# EAGLE schematic card (EAGLE 8.4.1)

## Sheet 1 of 2
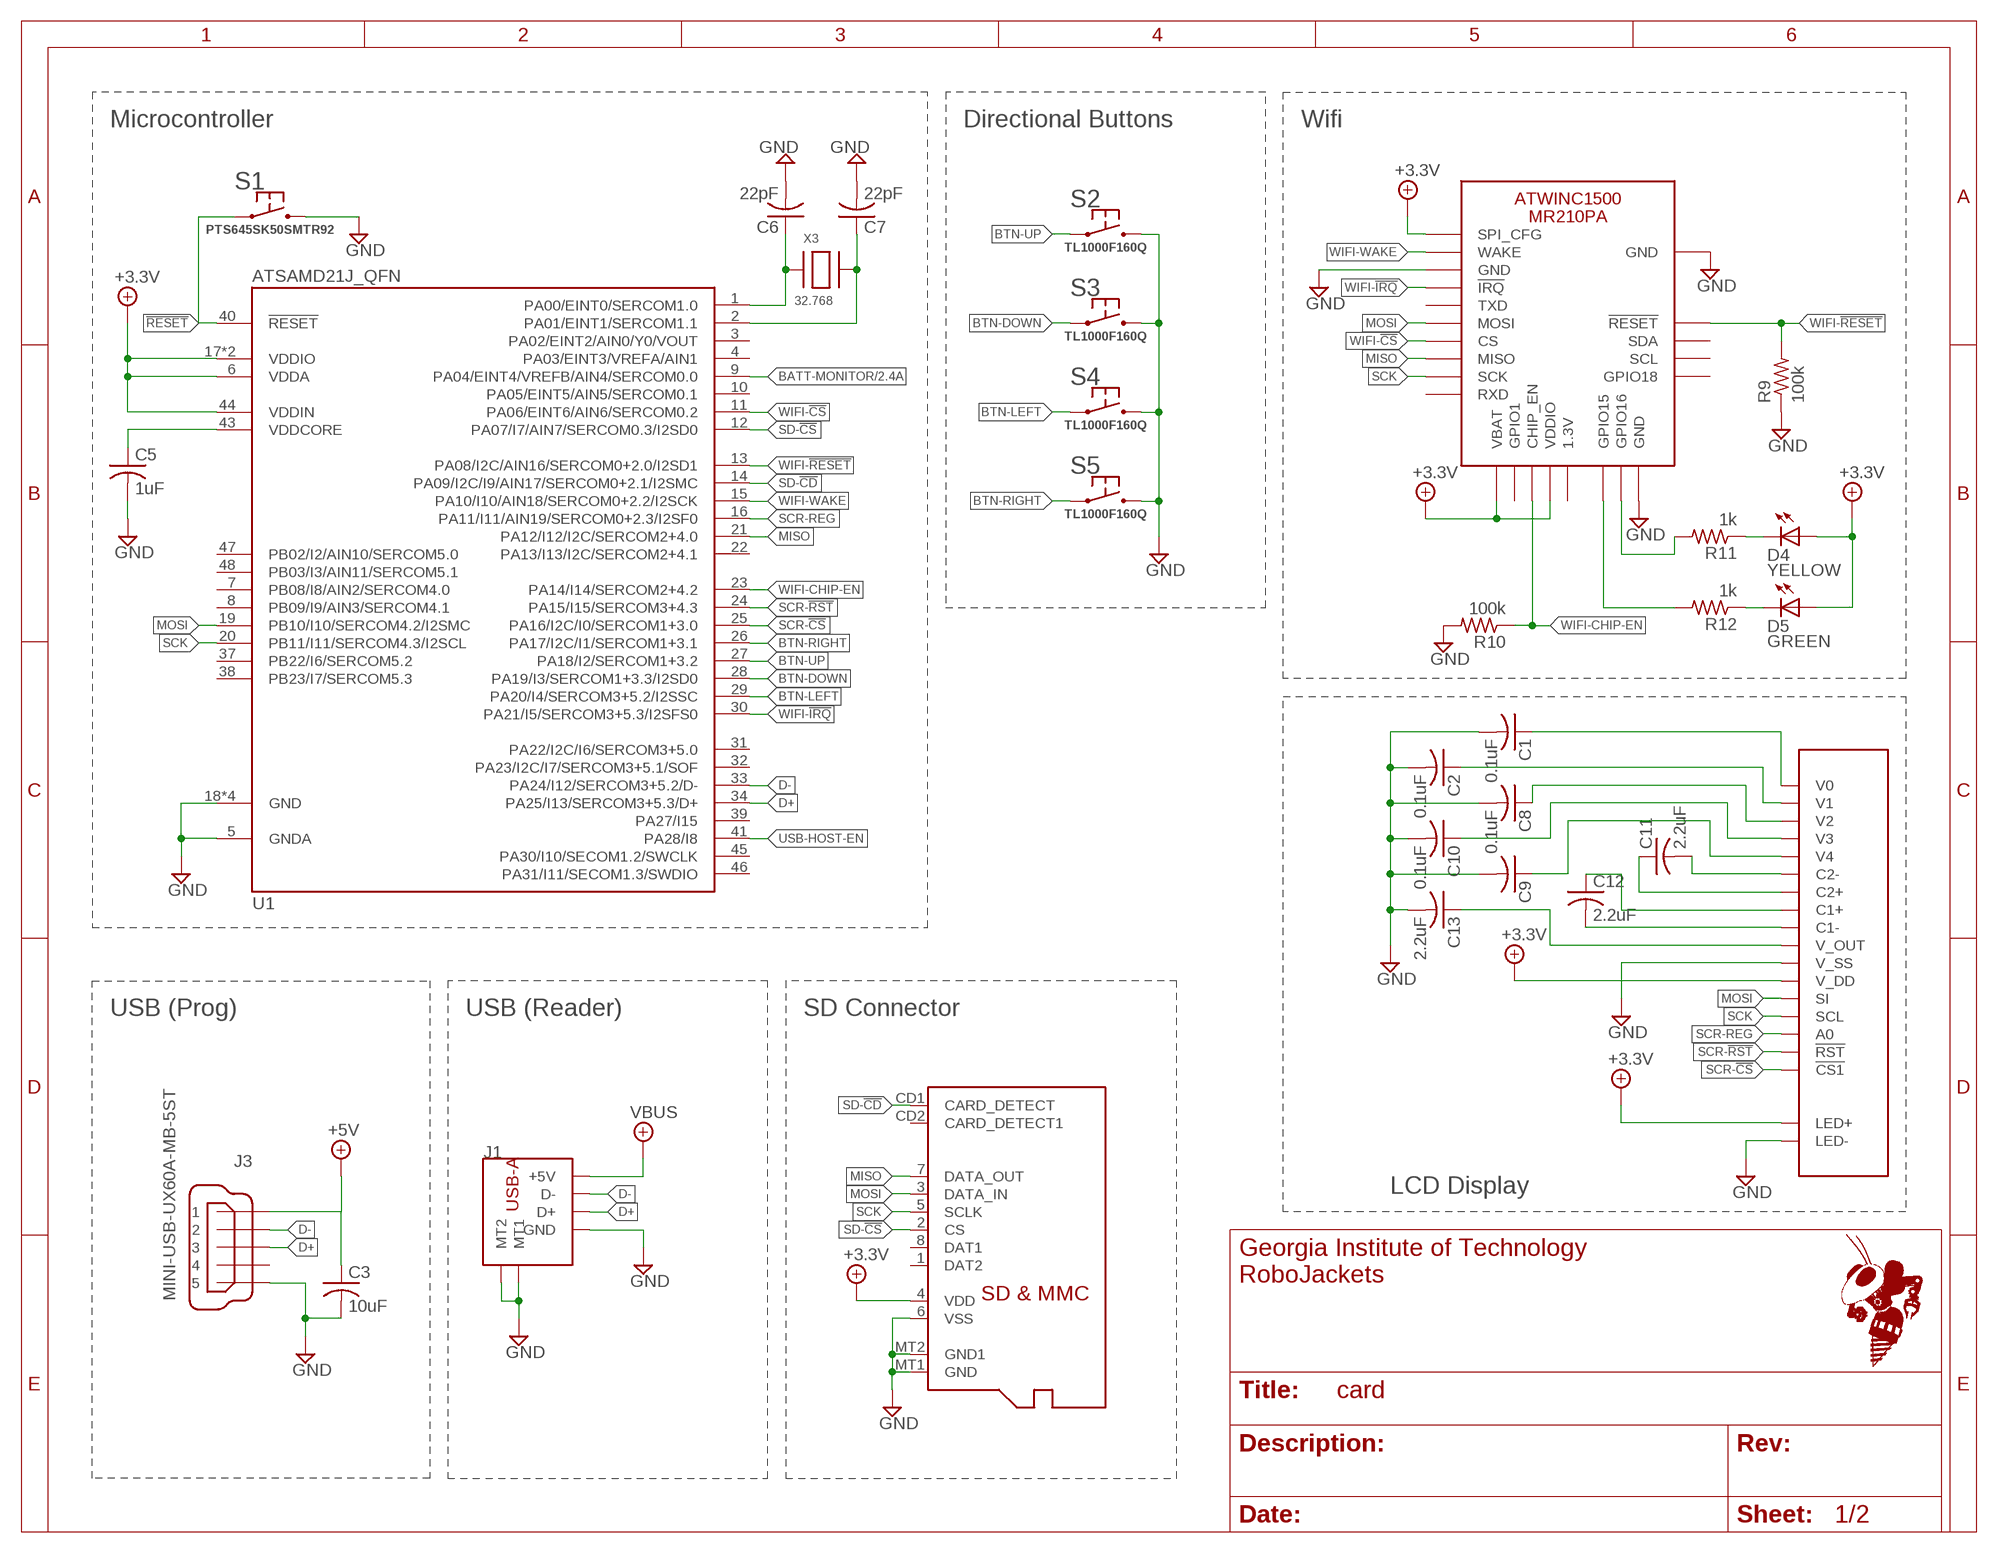
[diagram p0: schematic, sheet 1]
FRAME1 (FRAME_A_L): REVISION: 0.0; SCH_DESC: Standalone Magnetic card reader for Apiary; TEAM: Apiary

### Parts
C1  0.1uF  C-USC0603  [C0603]
C2  0.1uF  C-USC0603  [C0603]
C3  10uF  C-USC0805  [C0805]
C5  1uF  C-USC0603  [C0603]
C6  22pF  C-USC0603  [C0603]
C7  22pF  C-USC0603  [C0603]
C8  0.1uF  C-USC0603  [C0603]
C9  C-USC0603  [C0603]
C10  0.1uF  C-USC0603  [C0603]
C11  2.2uF  C-USC0603  [C0603]
C12  2.2uF  C-USC0603  [C0603]
C13  2.2uF  C-USC0603  [C0603]
D4  YELLOW  LED  [SMARTLED-TTW]
D5  GREEN  LED  [SMARTLED-TTW]
J1  UE27AC54100  [USB-A]
J3  MINI-USB-UX60A-MB-5ST  [UX60A-MB-5ST]
J4  MICROSD  [MICROSD]
R9  100k  R0603W  [R0603W]
R10  100k  R0603W  [R0603W]
R11  1k  R0603W  [R0603W]
R12  1k  R0603W  [R0603W]
S1  PTS645SK50SMTR92  [PTS645SK50SMTR92]
S2  TL1000F160Q  [TL1100]
S3  TL1000F160Q  [TL1100]
S4  TL1000F160Q  [TL1100]
S5  TL1000F160Q  [TL1100]
U1  ATSAMD21J_QFN  [TQFN48_7MM]
U4  ATWINC1500_MR210PA  [ATWINC1500_MR210PA]
U5  NHD-C12832A1Z-FSW-FBW-3V3  [NHD-C12832A1Z-FSW-FBW-3V3]
X3  32.768  XTAL-3.2X1.5  [XTAL3215]

### Nets
!RESET: S1.1 S1.2 U1.40(!RESET)
+3.3V: D4.A@1(A) D5.A@1(A) J4.4(VDD) U1.6(VDDA) U1.17(VDDIO) U1.36(VDDIO) U1.44(VDDIN) U4.J10(SPI_CFG) U4.J20(VBAT) U4.J23(VDDIO) U5.LED+ U5.V_DD ; also sheet 2
BATT-MONITOR: U1.9(PA04/EINT4/VREFB/AIN4/SERCOM0.0) ; also sheet 2
BTN-DOWN: S3.1 S3.2 U1.28(PA19/I3/SERCOM1+3.3/I2SD0)
BTN-LEFT: S4.1 S4.2 U1.29(PA20/I4/SERCOM3+5.2/I2SSC)
BTN-RIGHT: S5.1 S5.2 U1.26(PA17/I2C/I1/SERCOM1+3.1)
BTN-UP: S2.1 S2.2 U1.27(PA18/I2/SERCOM1+3.2)
D+: J1.3(D+) J3.3 U1.34(PA25/I13/SERCOM3+5.3/D+)
D-: J1.2(D-) J3.2 U1.33(PA24/I12/SERCOM3+5.2/D-)
GND: C1.2 C2.2 C3.2 C5.2 C6.2 C7.2 C8.2 C9.2 C10.2 C13.2 J1.4(GND) J1.MT1 J1.MT2 J3.5 J4.6(VSS) J4.MT1(GND) J4.MT2(GND1) R9.1(PIN1) R10.2(PIN2) S1.3 S1.4 S2.3 S2.4 S3.3 S3.4 S4.3 S4.4 S5.3 S5.4 U1.5(GNDA) U1.18(GND) U1.35(GND) U1.42(GND) U1.THERMAL(GND) U4.J9(GND) U4.J12(GND) U4.J28(GND) U5.LED- U5.V_SS ; also sheet 2
MISO: J4.7(DATA_OUT) U1.21(PA12/I12/I2C/SERCOM2+4.0) U4.J17(MISO)
MOSI: J4.3(DATA_IN) U1.19(PB10/I10/SERCOM4.2/I2SMC) U4.J15(MOSI) U5.SI
N$9: R11.2(PIN2) U4.J27(GPIO16)
N$10: R12.2(PIN2) U4.J26(GPIO15)
N$14: C5.1 U1.43(VDDCORE)
N$15: C6.1 U1.1(PA00/EINT0/SERCOM1.0) X3.P$1
N$16: C7.1 U1.2(PA01/EINT1/SERCOM1.1) X3.P$2
N$17: D4.C@1(C) R11.1(PIN1)
N$18: D5.C@1(C) R12.1(PIN1)
N$19: C1.1 U5.V0
N$20: C8.1 U5.V2
N$21: C10.1 U5.V3
N$22: C2.1 U5.V1
N$23: C9.1 U5.V4
N$24: C11.1 U5.C2+
N$25: C11.2 U5.C2-
N$26: C13.1 U5.V_OUT
N$27: C12.1
N$28: C12.2 U5.C1-
N$29: C3.1 J3.1
SCK: J4.5(SCLK) U1.20(PB11/I11/SERCOM4.3/I2SCL) U4.J18(SCK) U5.SCL
SCR-!CS: U1.25(PA16/I2C/I0/SERCOM1+3.0) U5.!CS1
SCR-!RST: U1.24(PA15/I15/SERCOM3+4.3) U5.!RST
SCR-REG: U1.16(PA11/I11/AIN19/SERCOM0+2.3/I2SF0) U5.A0
SD-!CD: J4.CD1(CARD_DETECT) U1.14(PA09/I2C/I9/AIN17/SERCOM0+2.1/I2SMC)
SD-!CS: J4.2(CS) U1.12(PA07/I7/AIN7/SERCOM0.3/I2SD0)
USB-HOST-EN: U1.41(PA28/I8)
VBUS: J1.1(+5V) ; also sheet 2
WIFI-!CS: U1.11(PA06/EINT6/AIN6/SERCOM0.2) U4.J16(CS)
WIFI-!IRQ: U1.30(PA21/I5/SERCOM3+5.3/I2SFS0) U4.J13(!IRQ)
WIFI-!RESET: R9.2(PIN2) U1.13(PA08/I2C/AIN16/SERCOM0+2.0/I2SD1) U4.J4(!RESET)
WIFI-CHIP-EN: R10.1(PIN1) U1.23(PA14/I14/SERCOM2+4.2) U4.J22(CHIP_EN)
WIFI-WAKE: U1.15(PA10/I10/AIN18/SERCOM0+2.2/I2SCK) U4.J11(WAKE)
Unconnected: J3.4 J4.1(DAT2) J4.8(DAT1) J4.CD2(CARD_DETECT1) U1.3(PA02/EINT2/AIN0/Y0/VOUT) U1.4(PA03/EINT3/VREFA/AIN1) U1.7(PB08/I8/AIN2/SERCOM4.0) U1.8(PB09/I9/AIN3/SERCOM4.1) U1.10(PA05/EINT5/AIN5/SERCOM0.1) U1.22(PA13/I13/I2C/SERCOM2+4.1) U1.31(PA22/I2C/I6/SERCOM3+5.0) U1.32(PA23/I2C/I7/SERCOM3+5.1/SOF) U1.37(PB22/I6/SERCOM5.2) U1.38(PB23/I7/SERCOM5.3) U1.39(PA27/I15) U1.45(PA30/I10/SECOM1.2/SWCLK) U1.46(PA31/I11/SECOM1.3/SWDIO) U1.47(PB02/I2/AIN10/SERCOM5.0) U1.48(PB03/I3/AIN11/SERCOM5.1) U4.J1(GPIO18) U4.J2(SCL) U4.J3(SDA) U4.J14(TXD) U4.J19(RXD) U4.J21(GPIO1) U4.J24(1.3V) U5.C1+

### Notes on the sheet
- Microcontroller | Directional Buttons | Wifi
- USB (Prog) | USB (Reader) | SD Connector
- LCD Display

## Sheet 2 of 2: Power
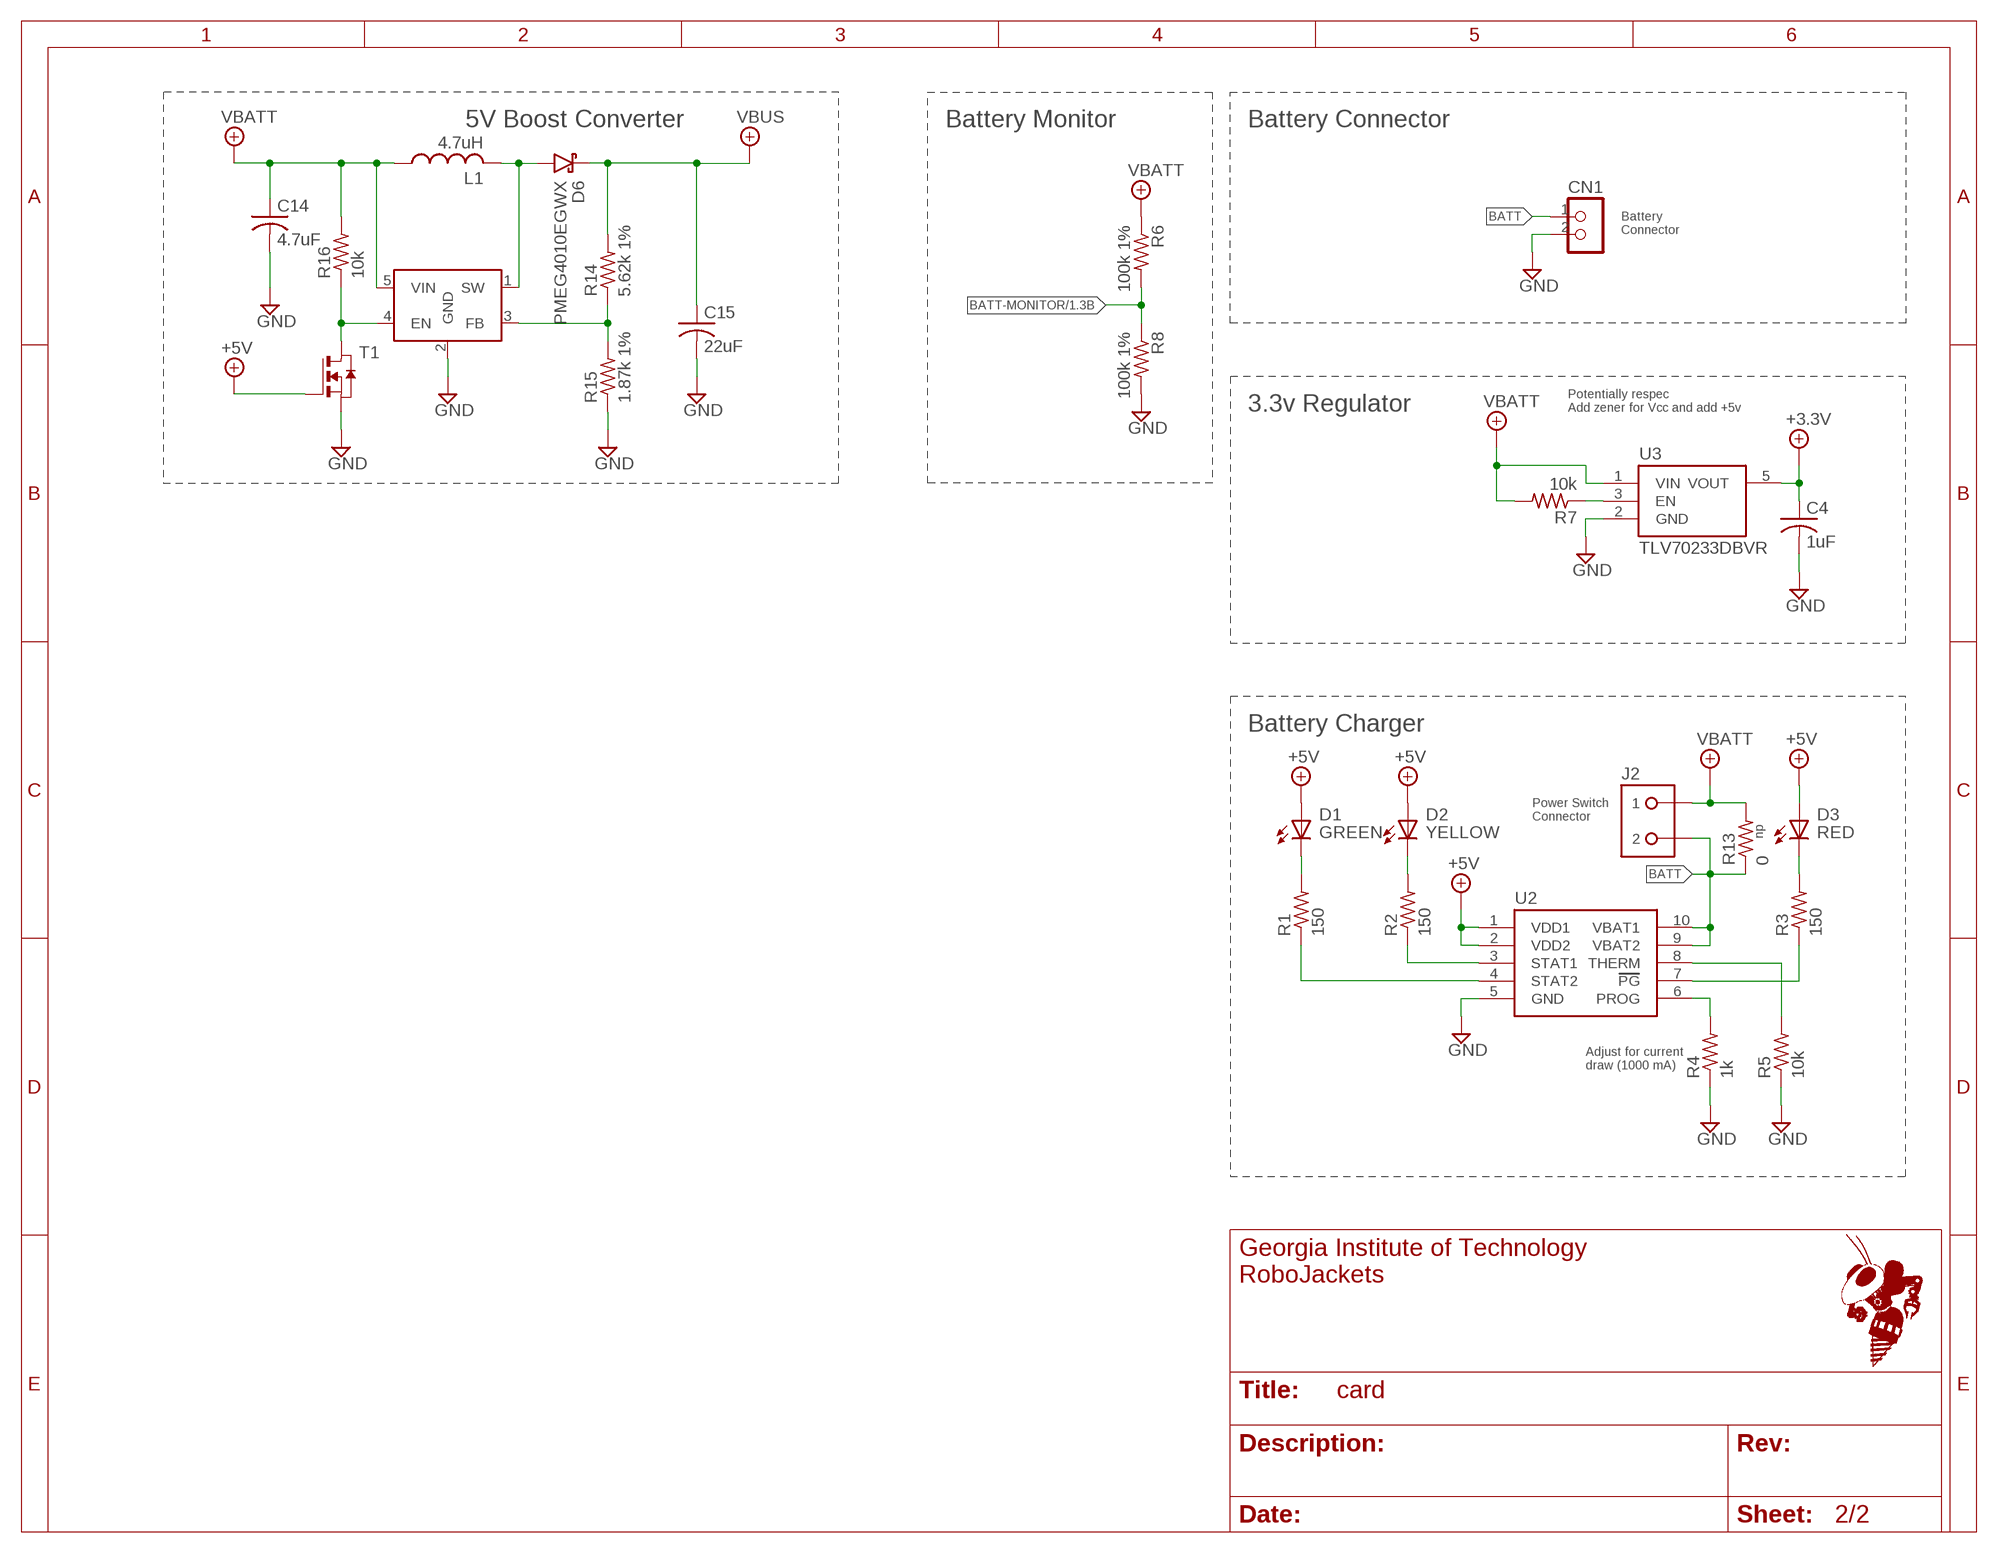
[diagram p1: schematic, sheet 2]

### Parts
C4  1uF  C-USC0603  [C0603]
C14  4.7uF  C-USC0603  [C0603]
C15  22uF  C-USC0603  [C0603]
CN1  JST_2PIN  [JSTPH2]
D1  GREEN  LED-SMD-GREEN  [CHIP-LED0603]
D2  YELLOW  LED-SMD-YELLOW  [CHIP-LED0603]
D3  RED  LED-SMD-RED  [CHIP-LED0603]
D6  PMEG4010EGWX  SCHOTTKEY-DIODE-SOD123  [SOD123]
J2  B2PS-VH(LF)(SN)  [B2PS-CENTERED]
L1  4.7uH  L-US-0805  [L0805]
R1  150  R-US_R0603  [R0603]
R2  150  R-US_R0603  [R0603]
R3  150  R-US_R0603  [R0603]
R4  1k  R-US_R0603  [R0603]
R5  10k  R-US_R0603  [R0603]
R6  100k 1%  R-US_R0603  [R0603]
R7  10k  R-US_R0603  [R0603]
R8  100k 1%  R-US_R0603  [R0603]
R13  0  R-US_R0603  [R0603]
R14  5.62k 1%  R-US_R0603  [R0603]
R15  1.87k 1%  R-US_R0603  [R0603]
R16  10k  R-US_R0603  [R0603]
T1  BSS138  [SOT-23]
U2  MCP73833  [MSOP10]
U3  TLV70233DBVR  [SOT-23-5]
U6  MIC2288YD5-TR  [TSOT-23-5]

### Nets
3V3_EN: R7.1 U3.3(EN)
+3.3V: C4.1 U3.5(VOUT) ; also sheet 1
+5V: D1.A D2.A D3.A T1.3(G) U2.1(VDD1) U2.2(VDD2) ; also sheet 1
BATT: CN1.1 J2.2 R13.1 U2.9(VBAT2) U2.10(VBAT1)
BATT-MONITOR: R6.2 R8.1 ; also sheet 1
BOOST_ENABLE: R16.1 T1.1(D) U6.4(EN)
BOOST_FB: R14.1 R15.2 U6.3(FB)
BOOST_SW: D6.A L1.2 U6.1(SW)
GND: C4.2 C14.2 C15.2 CN1.2 R4.1 R5.1 R8.2 R15.1 T1.2(S) U2.5(GND) U3.2(GND) U6.2(GND) ; also sheet 1
N$1: D1.C(K) R1.2
N$2: D2.C(K) R2.2
N$3: R2.1 U2.3(STAT1)
N$4: R1.1 U2.4(STAT2)
N$5: R3.1 U2.7(PG)
N$6: D3.C(K) R3.2
N$7: R4.2 U2.6(PROG)
N$8: R5.2 U2.8(THERM)
VBATT: C14.1 J2.1 L1.1 R6.1 R7.2 R13.2 R16.2 U3.1(VIN) U6.5(VIN)
VBUS: C15.1 D6.C R14.2 ; also sheet 1

### Notes on the sheet
- 5V Boost Converter | Battery Monitor | Battery Connector
- Battery
  Connector
- 3.3v Regulator
- Potentially respec
  Add zener for Vcc and add +5v
- Battery Charger
- Power Switch
  Connector
- np
- Adjust for current 
  draw (1000 mA)

## Library data of the parts
C1-C15 = rcl:C-US: CAPACITOR, American symbol
CN1 = lib-card:JST_2PIN: JST 2-Pin Right-Angle Connector PH-Series - 4UConnector: 17311 SH-Series - 4UConnector: 07278
D1 = lib-card:LED-SMD; DIGIKEY: 160-1446-1-ND; MPN: LTST-C191KGKT
D2 = lib-card:LED-SMD; DIGIKEY: 160-1448-1-ND; MPN: LTST-C191KSKT
D3 = lib-card:LED-SMD; DIGIKEY: 160-1447-1-ND; MPN: LTST-C191KRKT
D4 D5 = led:LED: LED OSRAM: - CHIPLED LG R971, LG N971, LY N971, LG Q971, LY Q971, LO R971, LY R971 LH N974, LH R974 LS Q976, LO Q976, LY Q976 LO Q996 - Hyper CHIPLED LW Q18S LB Q993, LB Q99A, LB R99A - SideLED LS A670, LO A670, LY A670, LG A670, LP A670 LB A673, LV A673, LT A673, LW A673 LH A674 LY A675 LS A676, LA A676, LO A676, LY A676, LW A676 LS A679, LY A679, LG A679 - Hyper Micro SIDELED® LS Y876, LA Y876, LO Y876, LY Y876 LT Y87S - SmartLED LW L88C, LW L88S LB L89C, LB L89S, LG L890 LS L89K, LO L89K, LY L89K LS L896, LA L896, LO L896, LY L896 - TOPLED LS T670, LO T670, LY T670, LG T670, LP T670 LSG T670, LSP T670, LSY T670, LOP T670, LYG T670 LG T671, LOG T671, LSG T671 LB T673, LV T673, LT T673, LW T673 LH T674 LS T676, LA T676, LO T676, LY T676, LB T676, LH T676, LSB T676, LW T676 LB T67C, LV T67C, LT T67C, LS T67K, LO T67K, LY T67K, LW E67C LS E67B, LA E67B, LO E67B, LY E67B, LB E67C, LV E67C, LT E67C LW T67C LS T679, LY T679, LG T679 LS T770, LO T770, LY T770, LG T770, LP T770 LB T773, LV T773, LT T773, LW T773 LH T774 LS E675, LA E675, LY E675, LS T675 LS T776, LA T776, LO T776, LY T776, LB T776 LHGB T686 LT T68C, LB T68C - Hyper Mini TOPLED® LB M676 - Mini TOPLED Santana® LG M470 LS M47K, LO M47K, LY M47K Source: http://www.osram.convergy.de LUXEON: - LUMILED® LXK2-PW12-R00, LXK2-PW12-S00, LXK2-PW14-U00, LXK2-PW14-V00 LXK2-PM12-R00, LXK2-PM12-S00, LXK2-PM14-U00 LXK2-PE12-Q00, LXK2-PE12-R00, LXK2-PE12-S00, LXK2-PE14-T00, LXK2-PE14-U00 LXK2-PB12-K00, LXK2-PB12-L00, LXK2-PB12-M00, LXK2-PB14-N00, LXK2-PB14-P00, LXK2-PB14-Q00 LXK2-PR12-L00, LXK2-PR12-M00, LXK2-PR14-Q00, LXK2-PR14-R00 LXK2-PD12-Q00, LXK2-PD12-R00, LXK2-PD12-S00 LXK2-PH12-R00, LXK2-PH12-S00 LXK2-PL12-P00, LXK2-PL12-Q00, LXK2-PL12-R00 Source: www.luxeon.com KINGBRIGHT: KA-3528ASYC Source: www.kingbright.com
D6 = CardReader:SCHOTTKEY-DIODE-
J1 = CardReader:UE27AC54100
J2 = RoboJackets-Connectors:B2P?-VH(LF)(SN): Power Connector Brand: JST Sales America Inc. <https://www.jst.com/> Series: VH <http://www.digikey.com/product-search/en?FV=fff40016,fff802f3,ffec0e9d> Distributor: Digi-Key <http://www.digikey.com/product-detail/en/B2PS-VH%28LF%29%28SN%29/455-1648-ND/926555>; DIGIKEY: 455-1648-ND; MPN: B2PS-VH(LF)(SN)
J3 = lib-card:MINI-USB-: MINI USB Connector Source: http://www.hirose.co.jp/cataloge_hp/e24000019.pdf; OC_FARNELL: unknown; OC_NEWARK: unknown
J4 = lib-card:MICROSD: Micro-SD / Transflash card holder with SPI pinout For the 3M # 2908-05WB-MG and/or 4UCON #19656 push-push type
L1 = CardReader:L-US
R1-R8 R13-R16 = rcl:R-US_: RESISTOR, American symbol
R9-R12 = RoboJackets-Resistors:R0603W
S1 = CardReader:PTS645SK50SMTR92
S2-S5 = CardReader:TL1000F160Q: Tactile Switch SPST-NO Top Actuated Through Hole
T1 = CardReader:BSS138: MOSFET N-CH 50V 22MA SOT-23; MPN: BSS138
U1 = lib-card:ATSAMD21J
U2 = lib-card:MCP73833: Lithium-Polymer/Lithium-Ion Battery Charger [Part No.] Microchip MCP73833 MSOP10 (tube only): Digikey: MCP73833T-AMI/UN or MCP73833-FCI/UN-ND Mouser: 579-MCP73833-AMI/UN DFN10 (tape): Digikey: Note Chips ending in 'AMI' have no timer, and chips ending in 'FCI' have a 6-hour timer that will end the charge sequence after 6 horus regqrdless of current charge level.
U3 = lib-card:TLV70233; DIGIKEY: 296-32415-1-ND; MPN: TLV70233DBVR
U4 = lib-card:ATWINC1500_MR210PA: ATWINC1500_MR210PA wifi module
U5 = CardReader:NHD-C12832A1Z-FSW-FBW-3V3: Graphic LCD Display Module Transflective Black (White - Inverted) FSTN - Film Super-Twisted Nematic SPI 128 x 32; MPN: NHD-C12832A1Z-FSW-FBW-3V3
U6 = CardReader:MIC2288YD5-TR: Boost Switching Regulator IC Positive Adjustable 2.5V 1 Output 1.2A (Switch) SOT-23-5 Thin, TSOT-23-5; MPN: MIC2288YD5-TR
X3 = lib-card:XTAL: Low cost SMT crystals, no capacitors included http://www.ladyada.net/library/eagle